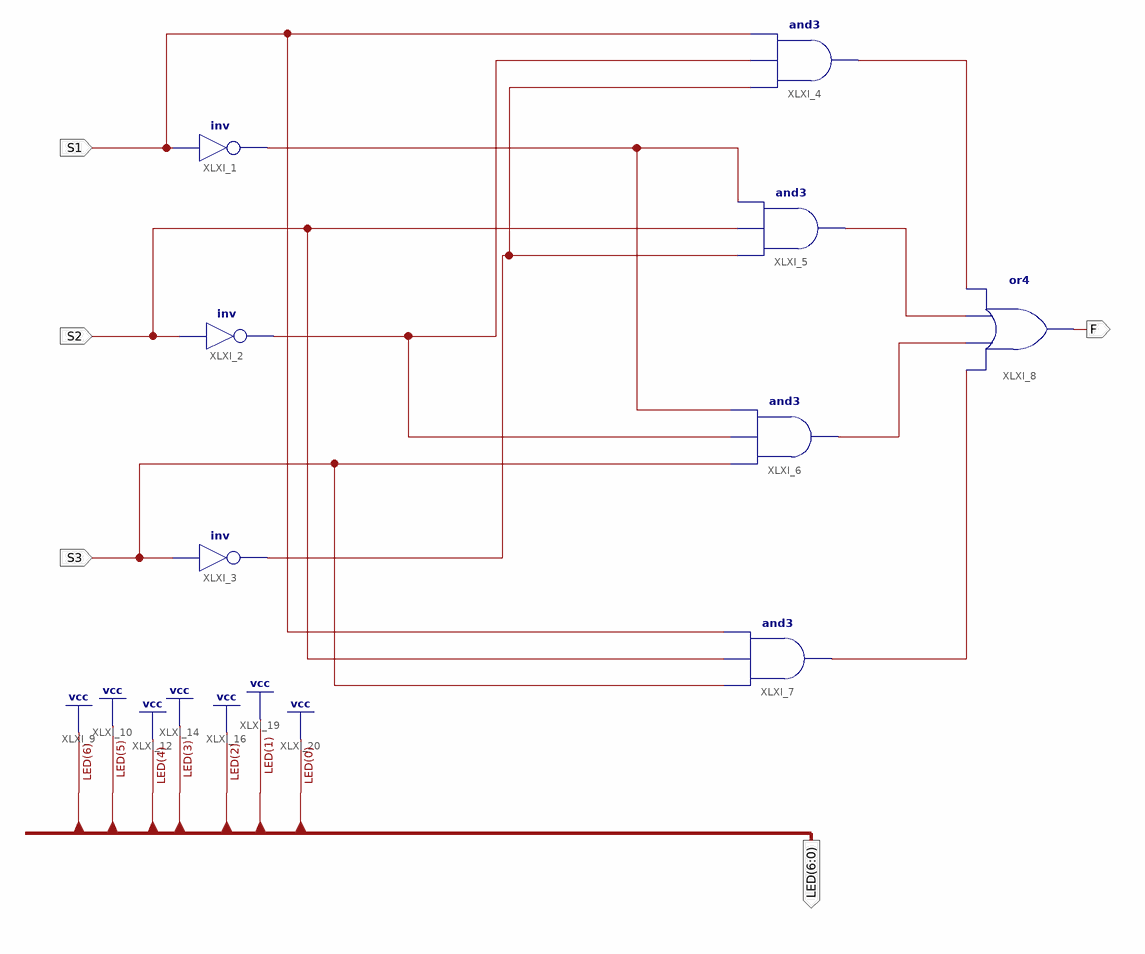
[diagram p0: schematic sheet 1]
// Xilinx ISE schematic LampCtrl_HDL.sch (kintex7) as structural Verilog: 8 symbols, 5 ports
module LampCtrl_HDL (
  input  S1,
  input  S2,
  input  S3,
  output F,
  output [6:0] LED
);

  wire XLXN_5, XLXN_6, XLXN_7, XLXN_25, XLXN_27, XLXN_28, XLXN_30;

  not XLXI_1 (XLXN_6, S1);
  not XLXI_2 (XLXN_27, S2);
  not XLXI_3 (XLXN_5, S3);
  and XLXI_4 (XLXN_7, XLXN_5, XLXN_27, S1);
  and XLXI_5 (XLXN_25, XLXN_5, S2, XLXN_6);
  and XLXI_6 (XLXN_28, S3, XLXN_27, XLXN_6);
  and XLXI_7 (XLXN_30, S3, S2, S1);
  or XLXI_8 (F, XLXN_30, XLXN_28, XLXN_25, XLXN_7);

  assign LED = {7{1'b1}};
endmodule
